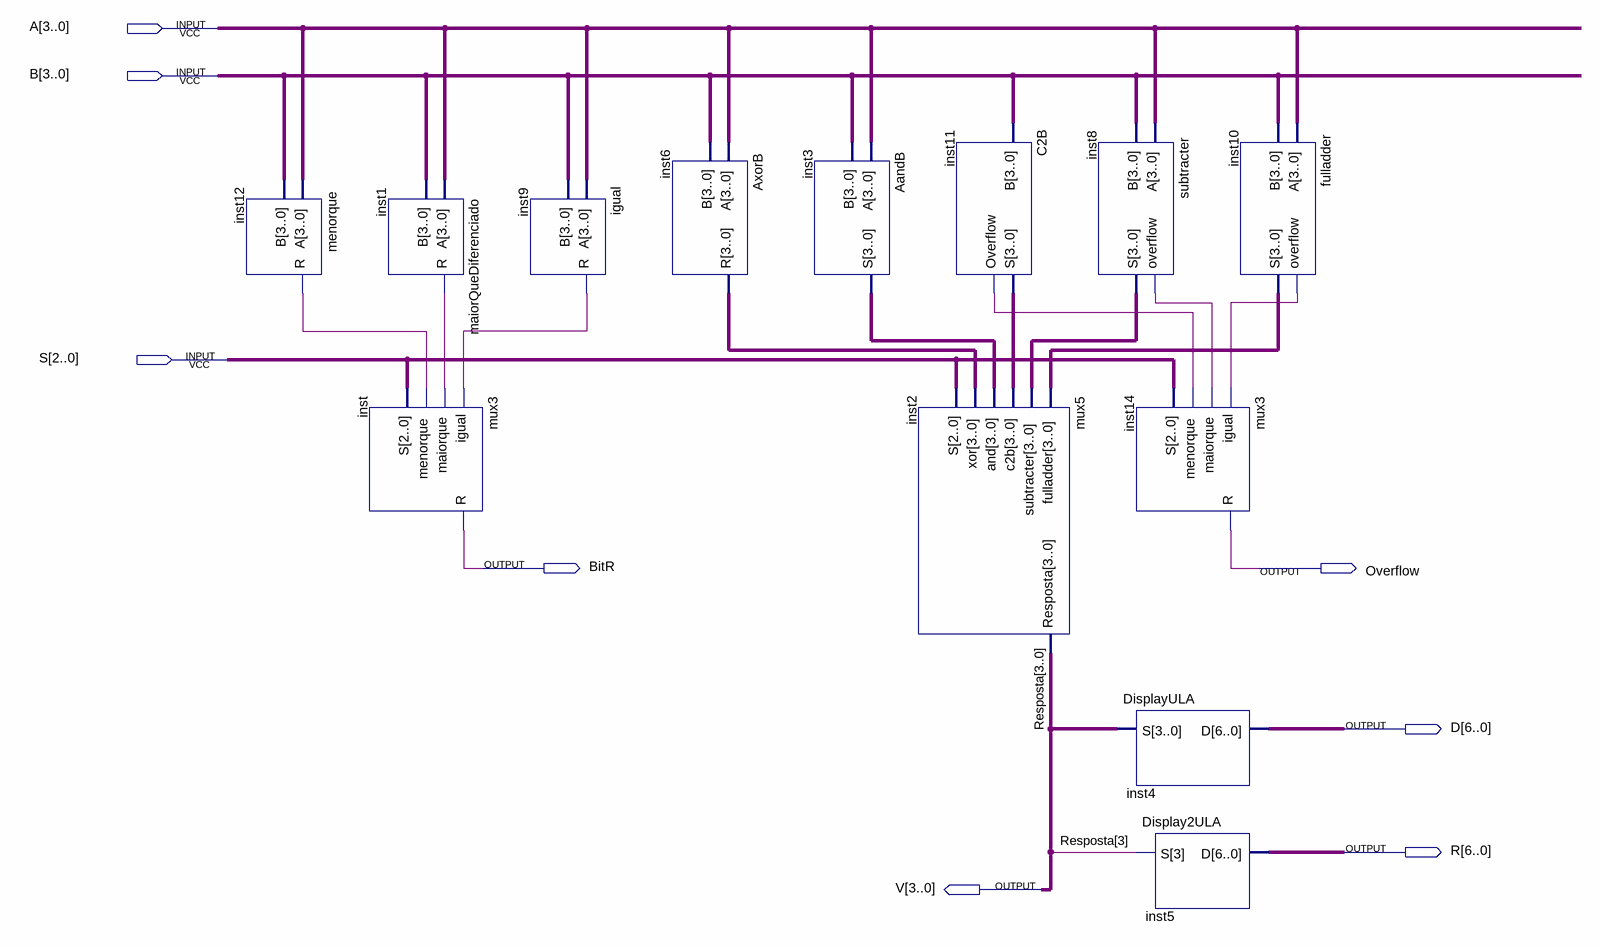
[diagram p0: schematic sheet]
// Quartus schematic ULA.bdf as structural Verilog: 13 symbols, 8 pins
module ULA (
  input  [3:0] A,
  input  [3:0] B,
  input  [2:0] S,
  output BitR,
  output Overflow,
  output [6:0] D,
  output [6:0] R,
  output [3:0] V
);

  wire inst1_r, inst8_overflow, inst9_r, inst10_overflow, inst11_overflow, inst12_r;
  wire [3:0] inst3_s, inst6_r, inst8_s, inst10_s, inst11_s;

  menorque inst12 (.A(A), .B(B), .R(inst12_r));
  maiorQueDiferenciado inst1 (.A(A), .B(B), .R(inst1_r));
  mux3 inst (.igual(inst9_r), .maiorque(inst1_r), .menorque(inst12_r), .S(S), .R(BitR));
  igual inst9 (.A(A), .B(B), .R(inst9_r));
  AxorB inst6 (.A(A), .B(B), .R(inst6_r));
  AandB inst3 (.A(A), .B(B), .S(inst3_s));
  mux5 inst2 (
    .fulladder(inst10_s), .subtracter(inst8_s), .c2b(inst11_s), .\and (inst3_s), .\xor (inst6_r), .S(S),
    .Resposta(V));
  C2B inst11 (.B(B), .S(inst11_s), .Overflow(inst11_overflow));
  subtracter inst8 (.A(A), .B(B), .overflow(inst8_overflow), .S(inst8_s));
  mux3 inst14 (.igual(inst10_overflow), .maiorque(inst8_overflow), .menorque(inst11_overflow), .S(S), .R(Overflow));
  DisplayULA inst4 (.S(V), .D(D));
  Display2ULA inst5 (.S(V[3]), .D(R));
  fulladder inst10 (.A(A), .B(B), .overflow(inst10_overflow), .S(inst10_s));

  // Other names for the same wires on the sheet: Resposta[3:0] = V
endmodule
